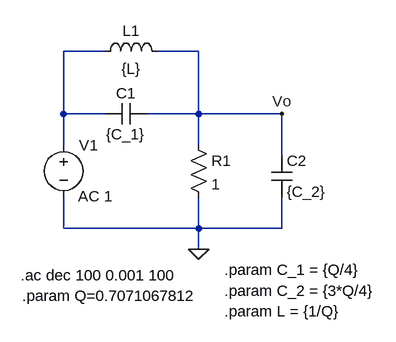
[diagram p0: schematic Ej2_a.asc]
Ej2_a.asc, the LTspice schematic file:
Version 4
SHEET 1 880 680
WIRE -32 48 -96 48
WIRE 112 48 48 48
WIRE -96 144 -96 48
WIRE -32 144 -96 144
WIRE 112 144 112 48
WIRE 112 144 32 144
WIRE 240 144 112 144
WIRE -96 192 -96 144
WIRE 112 192 112 144
WIRE 240 208 240 144
WIRE -96 320 -96 272
WIRE 112 320 112 272
WIRE 112 320 -96 320
WIRE 240 320 240 272
WIRE 240 320 112 320
WIRE 112 352 112 320
FLAG 112 352 0
FLAG 240 144 Vo
SYMBOL cap 32 128 R90
WINDOW 0 0 32 VBottom 2
WINDOW 3 32 32 VTop 2
SYMATTR InstName C1
SYMATTR Value {C_1}
SYMBOL res 96 176 R0
SYMATTR InstName R1
SYMATTR Value 1
SYMBOL voltage -96 176 R0
WINDOW 123 22 95 Left 2
WINDOW 39 0 0 Left 0
SYMATTR InstName V1
SYMATTR Value ""
SYMATTR Value2 AC 1
SYMBOL ind -48 64 R270
WINDOW 0 32 56 VTop 2
WINDOW 3 5 56 VBottom 2
SYMATTR InstName L1
SYMATTR Value {L}
SYMBOL cap 224 208 R0
SYMATTR InstName C2
SYMATTR Value {C_2}
TEXT -162 392 Left 2 !.ac dec 100 0.001 100
TEXT -160 424 Left 2 !.param Q=0.7071067812
TEXT 152 384 Left 2 !.param C_1 = {Q/4}
TEXT 152 416 Left 2 !.param C_2 = {3*Q/4}
TEXT 152 448 Left 2 !.param L = {1/Q}

The netlist it stands for:
* Ej2_a.asc
C1 Vo N001 {C_1}
R1 Vo 0 1
V1 N001 0 AC 1
L1 N001 Vo {L}
C2 Vo 0 {C_2}
.ac dec 100 0.001 100
.param Q=0.7071067812
.param C_1 = {Q/4}
.param C_2 = {3*Q/4}
.param L = {1/Q}
.backanno
.end